# EAGLE design scheda_trasduttori_v2 (EAGLE 6.5.0)

## Sheet 1 of 4
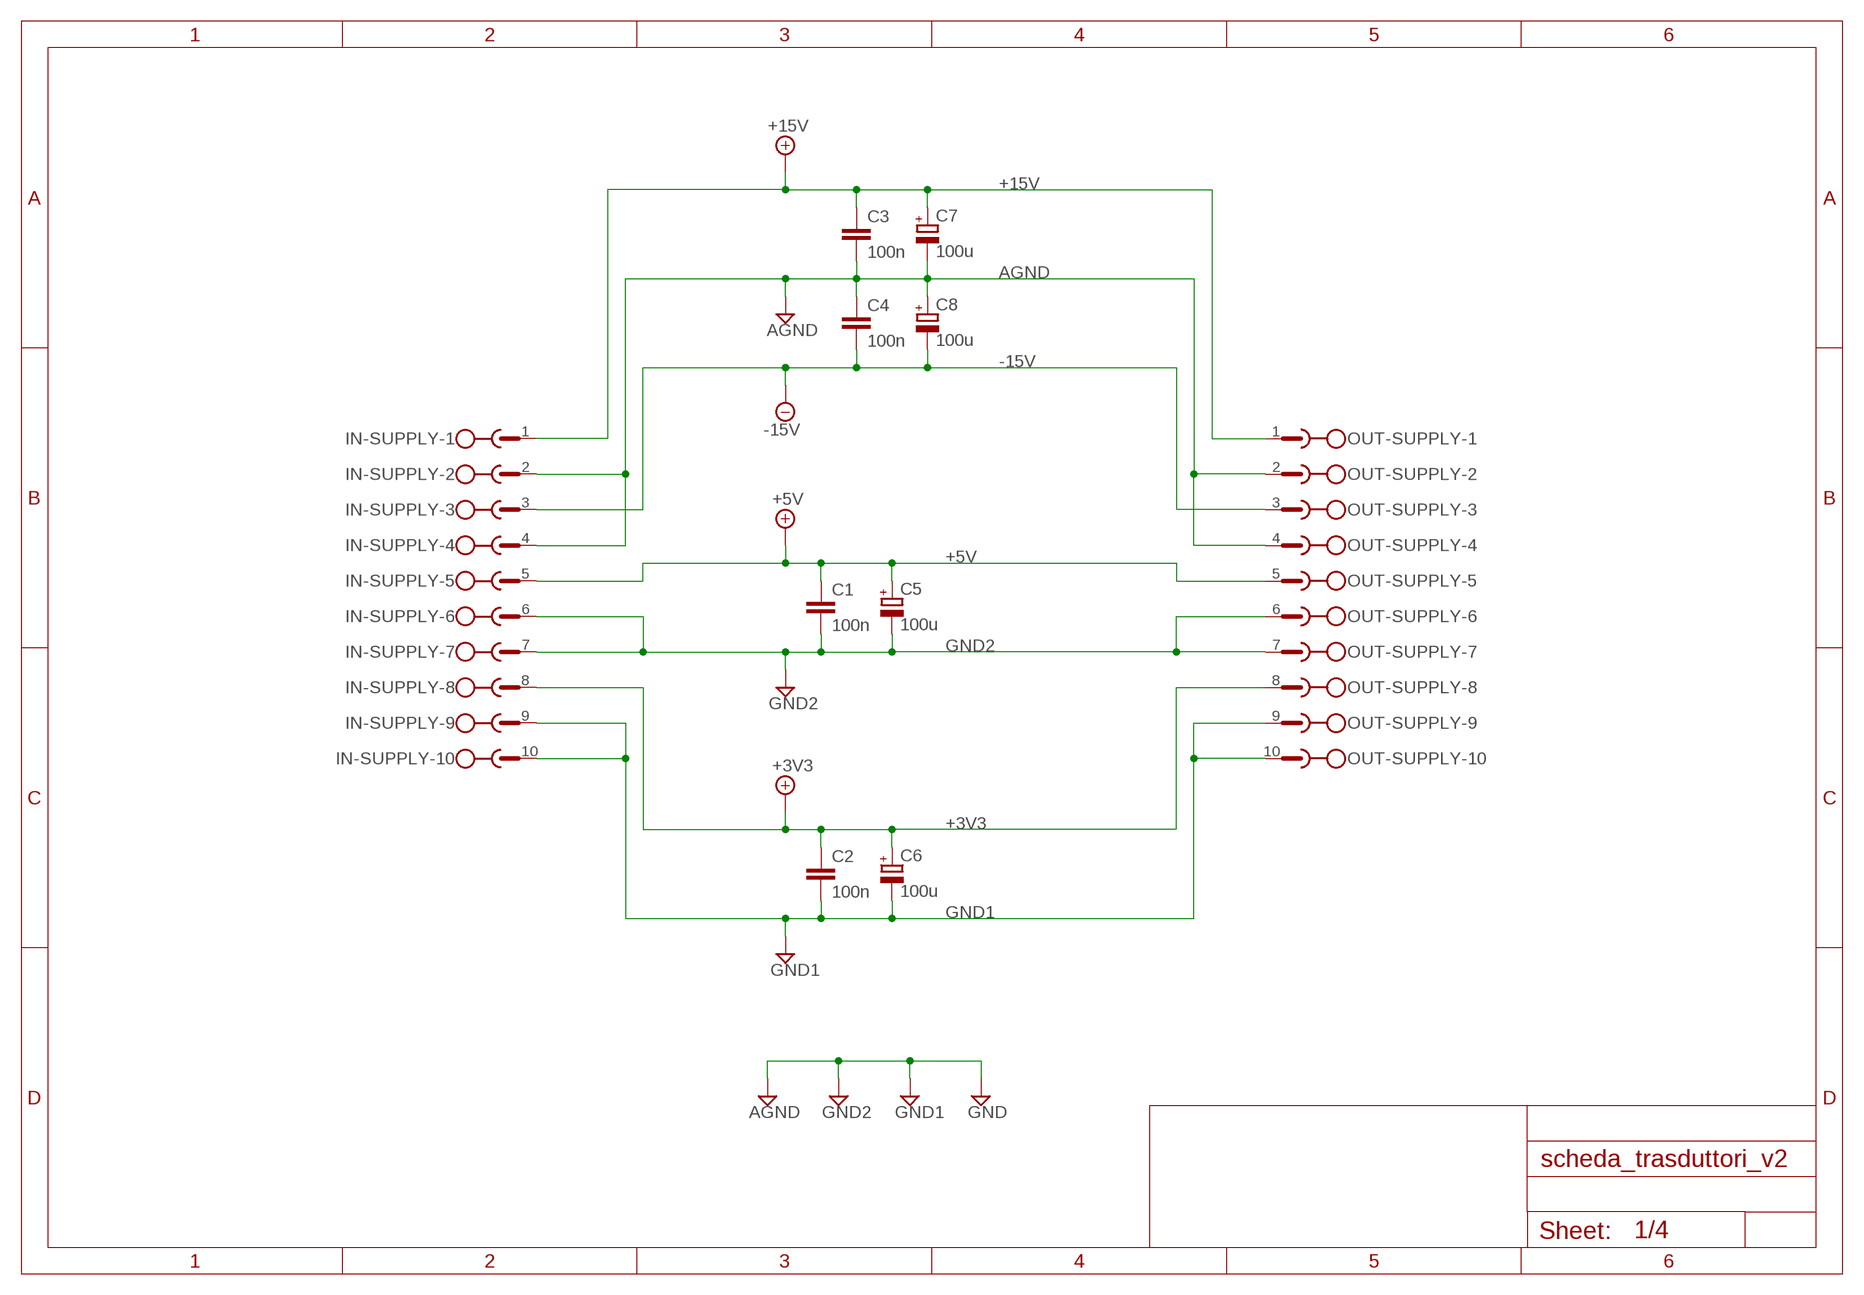
[diagram p0: schematic, sheet 1]

### Parts
C1  100n  C2,5-3  [C2.5-3]
C2  100n  C2,5-3  [C2.5-3]
C3  100n  C2,5-3  [C2.5-3]
C4  100n  C2,5-3  [C2.5-3]
C5  100u  CPOL-EUE2.5-7  [E2,5-7]
C6  100u  CPOL-EUE2.5-7  [E2,5-7]
C7  100u  CPOL-EUE2.5-7  [E2,5-7]
C8  100u  CPOL-EUE2.5-7  [E2,5-7]
IN-SUPPLY  MSTBA10  [MSTBA10]
OUT-SUPPLY  MSTBA10  [MSTBA10]

### Nets
+3V3: C2.1 C6.+ IN-SUPPLY.8 OUT-SUPPLY.8
+5V: C1.1 C5.+ IN-SUPPLY.5 OUT-SUPPLY.5 ; also sheet 2,4
+15V: C3.1 C7.+ IN-SUPPLY.1 OUT-SUPPLY.1 ; also sheet 2,3,4
-15V: C4.2 C8.- IN-SUPPLY.3 OUT-SUPPLY.3 ; also sheet 2,3,4
AGND: C3.2 C4.1 C7.- C8.+ IN-SUPPLY.2 IN-SUPPLY.4 OUT-SUPPLY.2 OUT-SUPPLY.4 ; also sheet 2,3,4
GND1: C2.2 C6.- IN-SUPPLY.9 IN-SUPPLY.10 OUT-SUPPLY.9 OUT-SUPPLY.10 ; also sheet 2,3
GND2: C1.2 C5.- IN-SUPPLY.6 IN-SUPPLY.7 OUT-SUPPLY.6 OUT-SUPPLY.7 ; also sheet 2,4

## Sheet 2 of 4
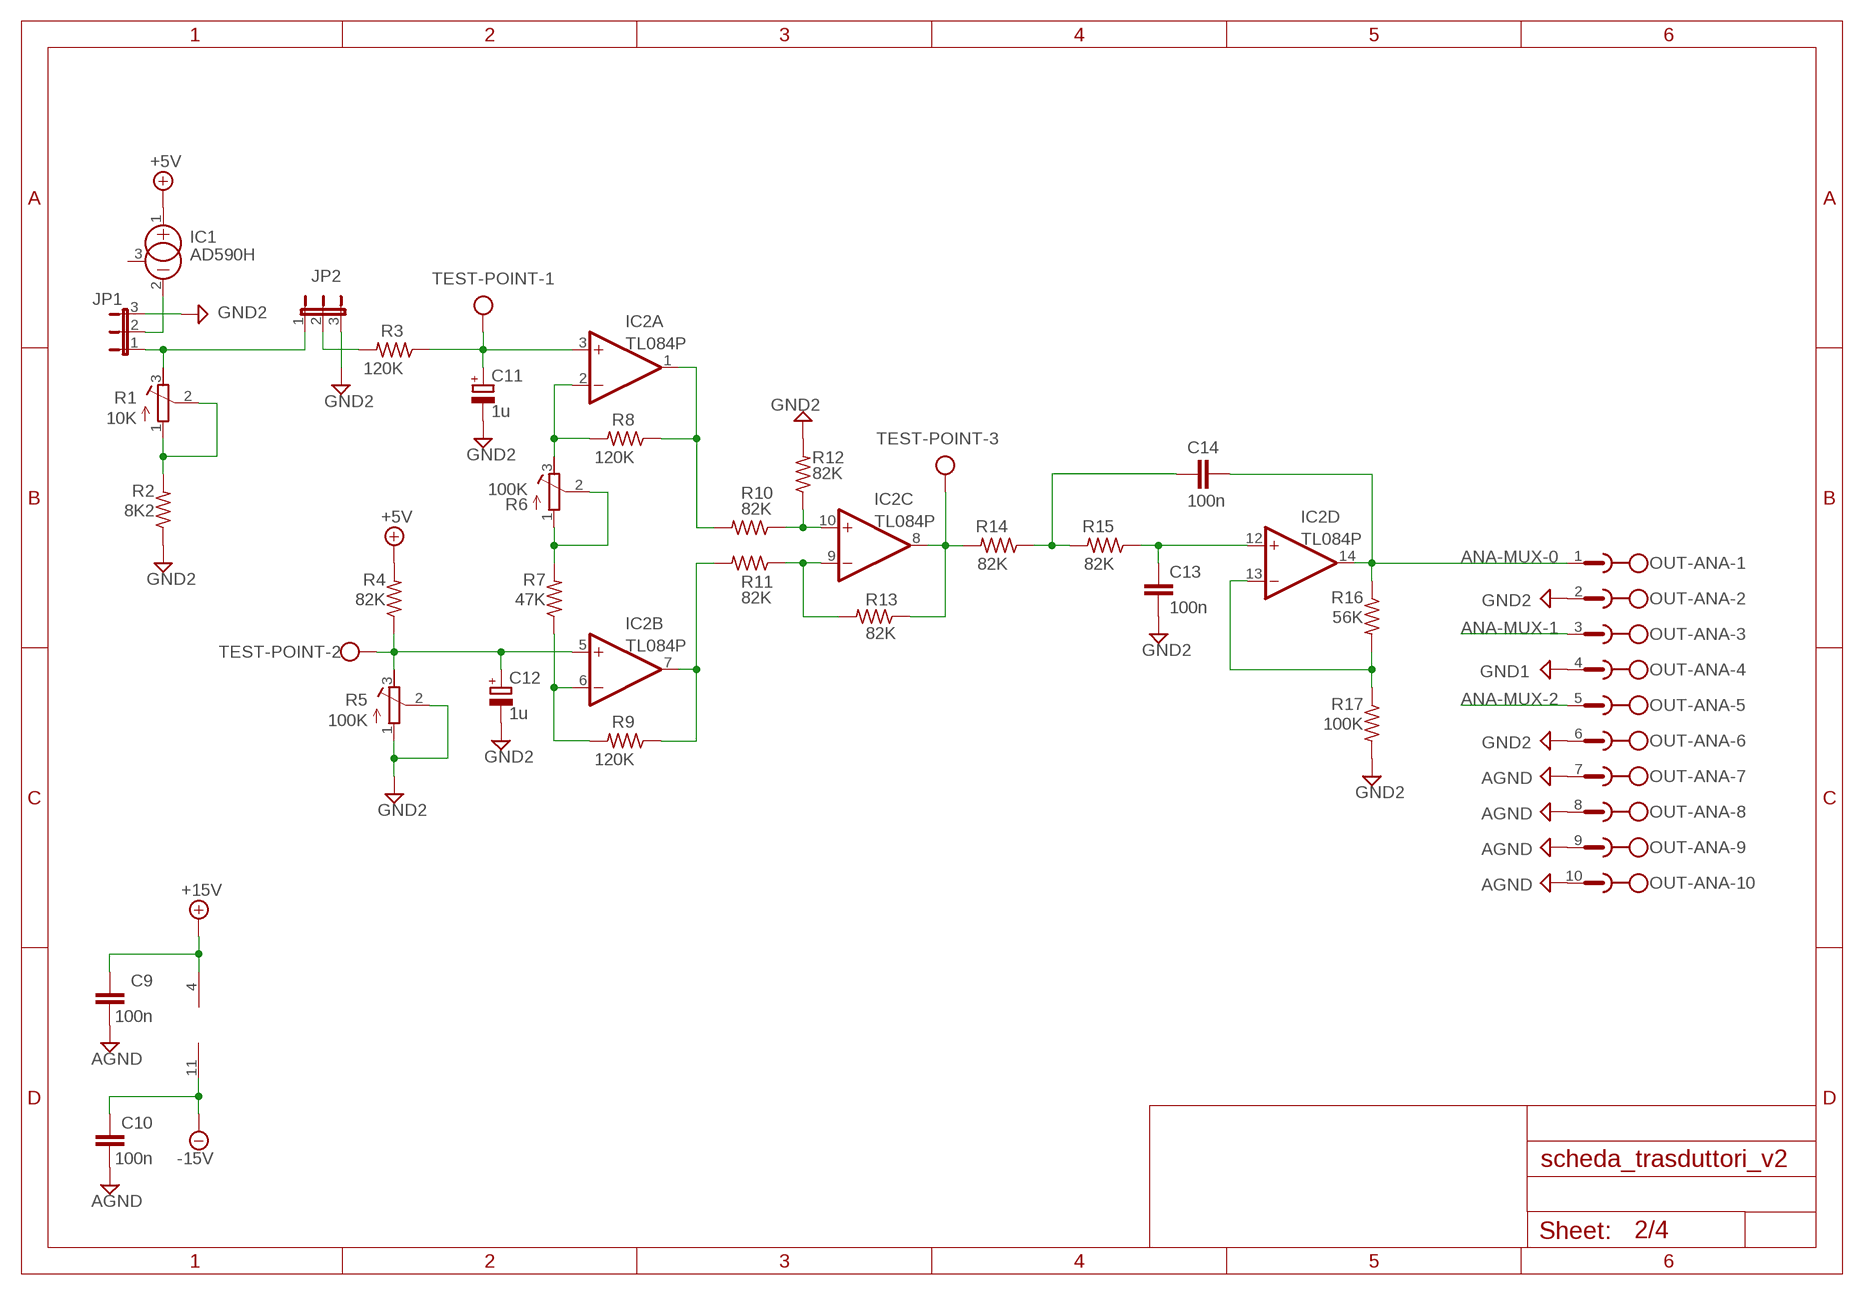
[diagram p1: schematic, sheet 2]

### Parts
C9  100n  C-EU025-024X044  [C025-024X044]
C10  100n  C-EU025-024X044  [C025-024X044]
C11  1u  CPOL-EUE5-8.5  [E5-8,5]
C12  1u  CPOL-EUE5-8.5  [E5-8,5]
C13  100n  C-EU025-024X044  [C025-024X044]
C14  100n  C-EU025-024X044  [C025-024X044]
IC1  AD590H  [TO18]
IC2  TL084P  [DIL14]
JP1  JP2E  [JP2]
JP2  JP2E  [JP2]
OUT-ANA  MSTBA10  [MSTBA10]
R1  10K  R-TRIMM64W  [RTRIM64W]
R2  8K2  R-US_0204/7  [0204/7]
R3  120K  R-US_0204/7  [0204/7]
R4  82K  R-US_0204/7  [0204/7]
R5  100K  R-TRIMM64W  [RTRIM64W]
R6  100K  R-TRIMM64W  [RTRIM64W]
R7  47K  R-US_0204/7  [0204/7]
R8  120K  R-US_0204/7  [0204/7]
R9  120K  R-US_0204/7  [0204/7]
R10  82K  R-US_0204/7  [0204/7]
R11  82K  R-US_0204/7  [0204/7]
R12  82K  R-US_0204/7  [0204/7]
R13  82K  R-US_0204/7  [0204/7]
R14  82K  R-US_0204/7  [0204/7]
R15  82K  R-US_0204/7  [0204/7]
R16  56K  R-US_0204/7  [0204/7]
R17  100K  R-US_0204/7  [0204/7]
TEST-POINT  W237-103  [W237-103]

### Nets
+5V: IC1.1(+) R4.2 ; also sheet 1,4
+15V: C9.2 IC2.4(P:V+) ; also sheet 1,3,4
-15V: C10.2 IC2.11(P:V-) ; also sheet 1,3,4
AGND: C9.1 C10.1 OUT-ANA.7 OUT-ANA.8 OUT-ANA.9 OUT-ANA.10 ; also sheet 1,3,4
ANA-MUX-0: C14.2 IC2.14(D:OUT) OUT-ANA.1 R16.1
ANA-MUX-1: OUT-ANA.3 ; also sheet 3
ANA-MUX-2: OUT-ANA.5 ; also sheet 4
GND1: OUT-ANA.4 ; also sheet 1,3
GND2: C11.- C12.- C13.1 JP1.3 JP2.3 OUT-ANA.2 OUT-ANA.6 R2.1 R5.1(E) R5.2(S) R12.2 R17.2 ; also sheet 1,4
N$1: R1.1(E) R1.2(S) R2.2
N$2: IC1.2(-) JP1.2
N$3: R6.1(E) R6.2(S) R7.2
N$4: C11.+ IC2.3(A:+IN) R3.1 TEST-POINT.1
N$5: IC2.2(A:-IN) R6.3(A) R8.2
N$6: IC2.1(A:OUT) R8.1 R10.2
N$7: JP2.2 R3.2
N$8: JP1.1 JP2.1 R1.3(A)
N$9: C12.+ IC2.5(B:+IN) R4.1 R5.3(A) TEST-POINT.2
N$10: IC2.6(B:-IN) R7.1 R9.2
N$11: IC2.7(B:OUT) R9.1 R11.2
N$12: IC2.10(C:+IN) R10.1 R12.1
N$13: IC2.9(C:-IN) R11.1 R13.2
N$14: IC2.8(C:OUT) R13.1 R14.2 TEST-POINT.3
N$16: C14.1 R14.1 R15.2
N$17: C13.2 IC2.12(D:+IN) R15.1
N$18: IC2.13(D:-IN) R16.2 R17.1
Unconnected: IC1.3(CAN)

## Sheet 3 of 4
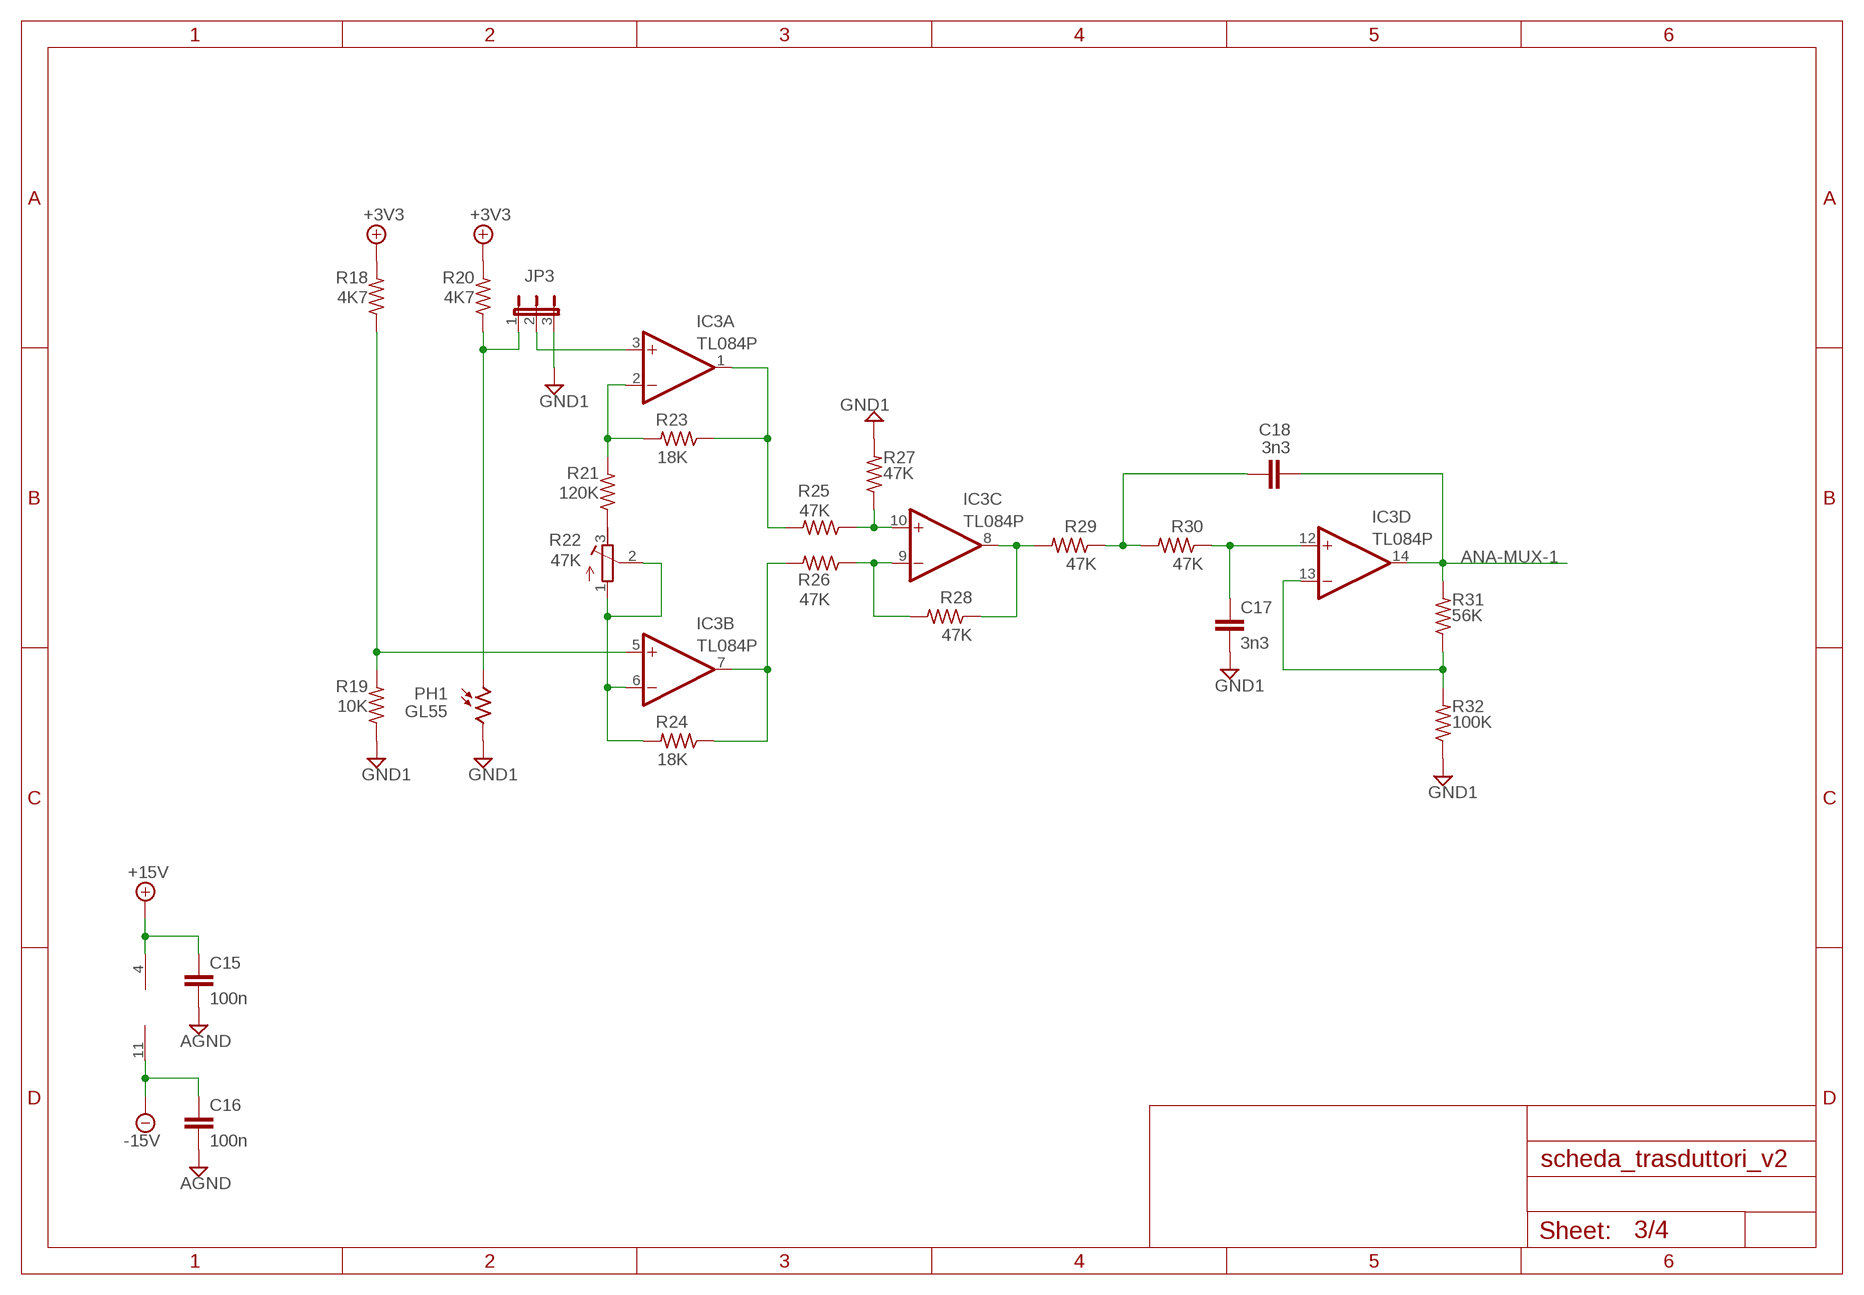
[diagram p2: schematic, sheet 3]

### Parts
C15  100n  C-EU025-025X050  [C025-025X050]
C16  100n  C-EU025-025X050  [C025-025X050]
C17  3n3  C-EU025-025X050  [C025-025X050]
C18  3n3  C-EU025-025X050  [C025-025X050]
IC3  TL084P  [DIL14]
JP3  JP2E  [JP2]
PH1  GL55  A1050_09  [T0-46-A10XX]
R18  4K7  R-US_0204/7  [0204/7]
R19  10K  R-US_0204/7  [0204/7]
R20  4K7  R-US_0204/7  [0204/7]
R21  120K  R-US_0204/7  [0204/7]
R22  47K  R-TRIMM64W  [RTRIM64W]
R23  18K  R-US_0204/7  [0204/7]
R24  18K  R-US_0204/7  [0204/7]
R25  47K  R-US_0204/7  [0204/7]
R26  47K  R-US_0204/7  [0204/7]
R27  47K  R-US_0204/7  [0204/7]
R28  47K  R-US_0204/7  [0204/7]
R29  47K  R-US_0204/7  [0204/7]
R30  47K  R-US_0204/7  [0204/7]
R31  56K  R-US_0204/7  [0204/7]
R32  100K  R-US_0204/7  [0204/7]

### Nets
+4.1V: R18.2 R20.2 ; supply symbol labelled +3V3
+15V: C15.1 IC3.4(P:V+) ; also sheet 1,2,4
-15V: C16.1 IC3.11(P:V-) ; also sheet 1,2,4
AGND: C15.2 C16.2 ; also sheet 1,2,4
ANA-MUX-1: C18.2 IC3.14(D:OUT) R31.2 ; also sheet 2
GND1: C17.2 JP3.3 PH1.2 R19.1 R27.2 R32.1 ; also sheet 1,2
N$15: IC3.5(B:+IN) R18.1 R19.2
N$19: JP3.1 PH1.1 R20.1
N$20: R21.1 R22.3(A)
N$21: IC3.6(B:-IN) R22.1(E) R22.2(S) R24.2
N$22: IC3.7(B:OUT) R24.1 R26.2
N$23: IC3.1(A:OUT) R23.1 R25.2
N$24: IC3.2(A:-IN) R21.2 R23.2
N$25: IC3.10(C:+IN) R25.1 R27.1
N$26: IC3.9(C:-IN) R26.1 R28.2
N$27: IC3.8(C:OUT) R28.1 R29.2
N$28: C17.1 IC3.12(D:+IN) R30.1
N$29: IC3.13(D:-IN) R31.1 R32.2
N$30: C18.1 R29.1 R30.2
N$31: IC3.3(A:+IN) JP3.2

## Sheet 4 of 4
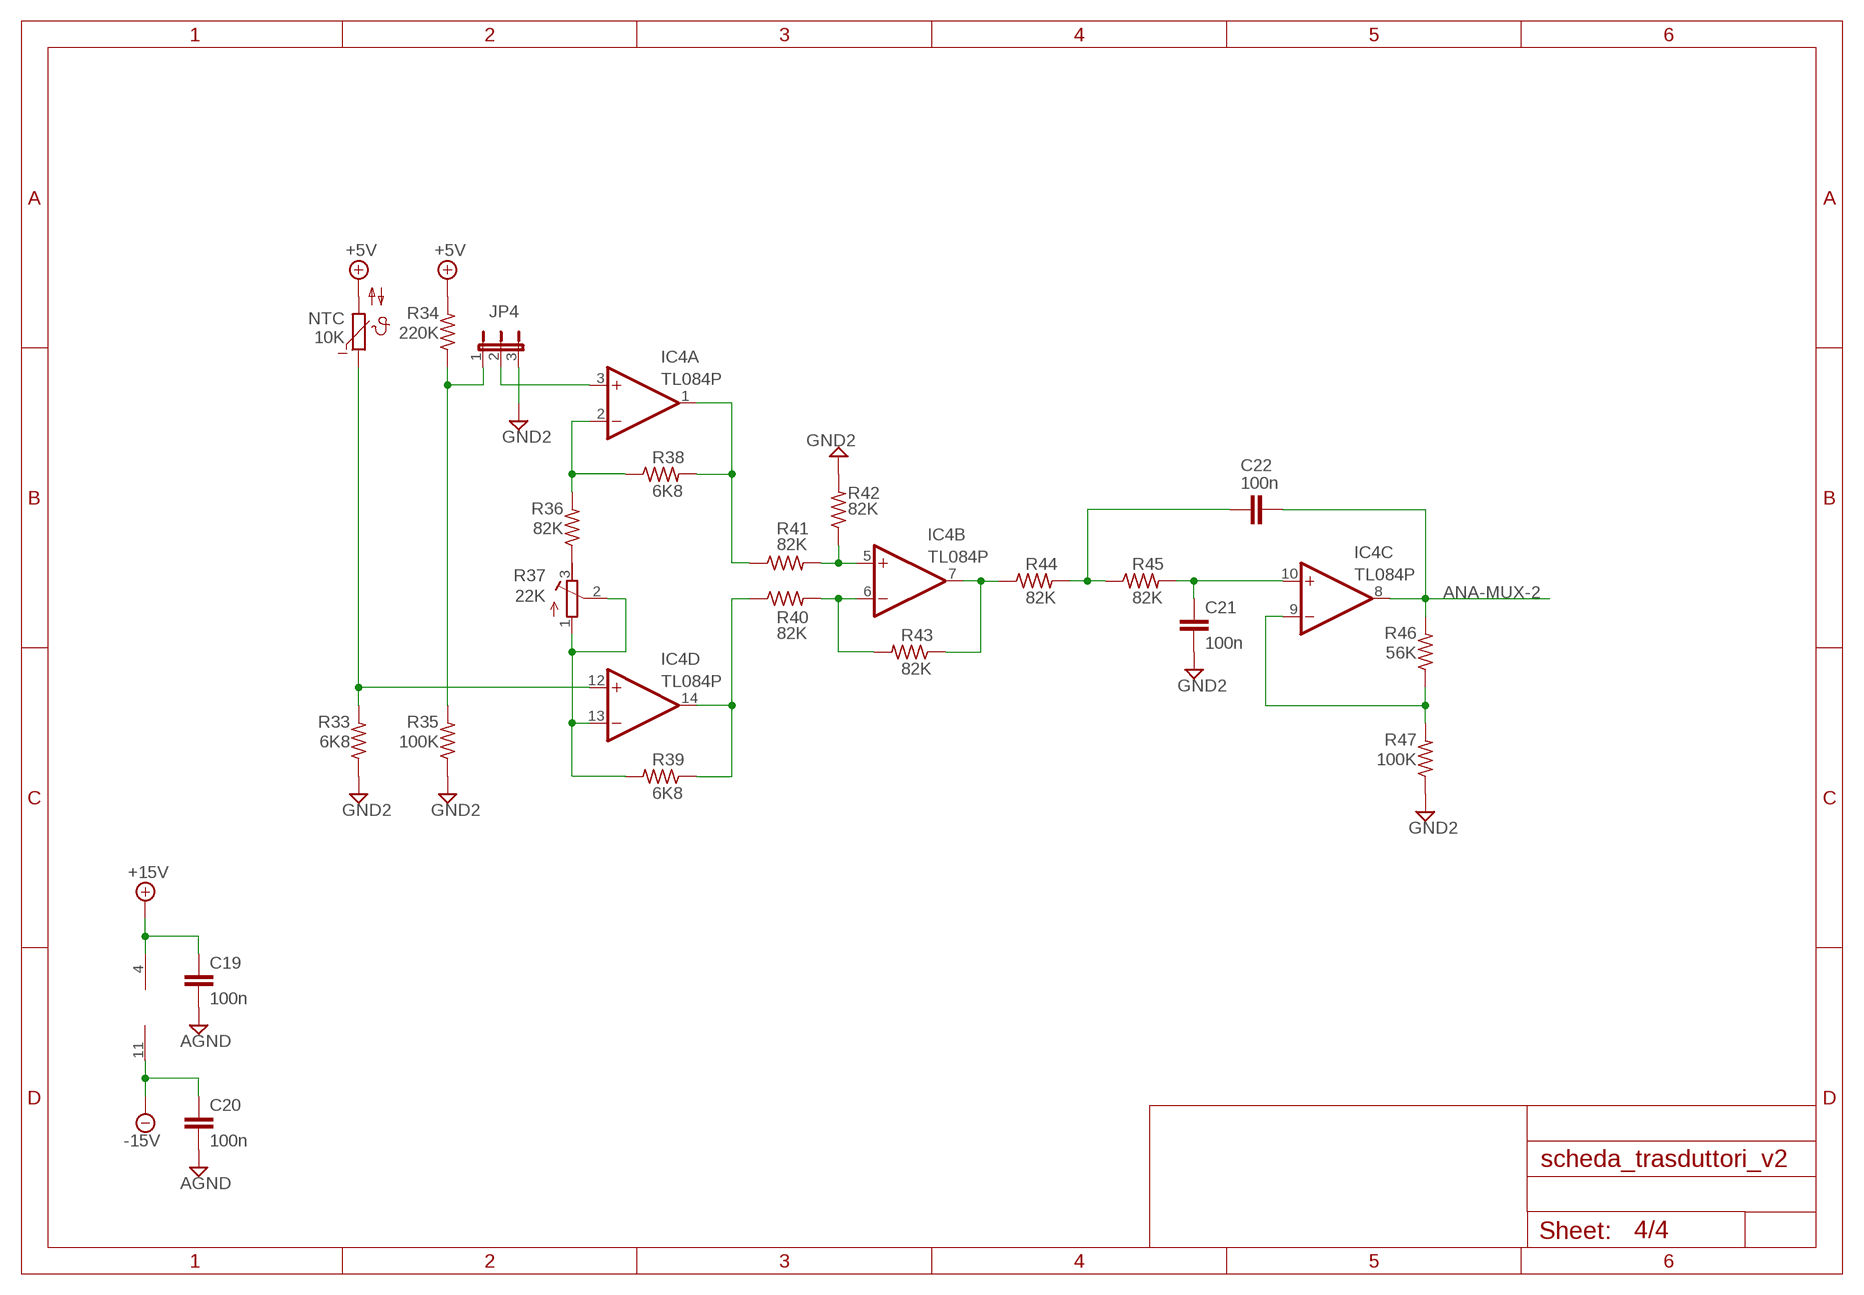
[diagram p3: schematic, sheet 4]

### Parts
C19  100n  C-EU025-025X050  [C025-025X050]
C20  100n  C-EU025-025X050  [C025-025X050]
C21  100n  C-EU025-025X050  [C025-025X050]
C22  100n  C-EU025-025X050  [C025-025X050]
IC4  TL084P  [DIL14]
JP4  JP2E  [JP2]
NTC  10K  NTC640  [P640]
R33  6K8  R-US_0204/7  [0204/7]
R34  220K  R-US_0204/7  [0204/7]
R35  100K  R-US_0204/7  [0204/7]
R36  82K  R-US_0204/7  [0204/7]
R37  22K  R-TRIMM64W  [RTRIM64W]
R38  6K8  R-US_0204/7  [0204/7]
R39  6K8  R-US_0204/7  [0204/7]
R40  82K  R-US_0204/7  [0204/7]
R41  82K  R-US_0204/7  [0204/7]
R42  82K  R-US_0204/7  [0204/7]
R43  82K  R-US_0204/7  [0204/7]
R44  82K  R-US_0204/7  [0204/7]
R45  82K  R-US_0204/7  [0204/7]
R46  56K  R-US_0204/7  [0204/7]
R47  100K  R-US_0204/7  [0204/7]

### Nets
+5V: NTC.2 R34.2 ; also sheet 1,2
+15V: C19.1 IC4.4(P:V+) ; also sheet 1,2,3
-15V: C20.1 IC4.11(P:V-) ; also sheet 1,2,3
AGND: C19.2 C20.2 ; also sheet 1,2,3
ANA-MUX-2: C22.2 IC4.8(C:OUT) R46.2 ; also sheet 2
GND2: C21.2 JP4.3 R33.1 R35.1 R42.2 R47.1 ; also sheet 1,2
N$32: C21.1 IC4.10(C:+IN) R45.2
N$33: IC4.9(C:-IN) R46.1 R47.2
N$34: C22.1 R44.2 R45.1
N$35: IC4.12(D:+IN) NTC.1 R33.2
N$36: R36.1 R37.3(A)
N$37: IC4.2(A:-IN) R36.2 R38.1
N$38: IC4.1(A:OUT) R38.2 R40.1
N$39: IC4.13(D:-IN) R37.1(E) R37.2(S) R39.2
N$40: IC4.14(D:OUT) R39.1 R41.1
N$41: IC4.6(B:-IN) R41.2 R43.2
N$42: IC4.5(B:+IN) R40.2 R42.1
N$43: IC4.7(B:OUT) R43.1 R44.1
N$44: JP4.1 R34.1 R35.2
N$45: IC4.3(A:+IN) JP4.2

## Library data of the parts
C1-C4 = capacitor-wima:C: CAPACITOR naming: grid - package width
C5-C8 C11 C12 = rcl:CPOL-EU: POLARIZED CAPACITOR, European symbol
C9 C10 C13-C22 = rcl:C-EU: CAPACITOR, European symbol
IC1 = linear:AD590H: TEMPERATURE SENSOR current output
IC2-IC4 = linear:TL084: OP AMP
IN-SUPPLY OUT-ANA OUT-SUPPLY = ITIS:MSTBA10
JP1-JP4 = jumper:JP2E: JUMPER
NTC = ptc-ntc:NTC640: PHILIPS NTC; OC_FARNELL: unknown; OC_NEWARK: unknown
PH1 = photo-elements:A10: Sensor Robust Light Sensing Applications Outdoor Light Sensing Application Source: http://optoelectronics.perkinelmer.com/content/Datasheets/DTS_PhotocellsA1050.pdf; TYPE: GL55
R1 R5 R6 R22 R37 = resistor:R-TRIMM: Trimm resistor
R2-R4 R7-R21 R23-R32 = rcl:R-US_: RESISTOR, American symbol
R33-R36 R38-R47 = resistor:R-US_: RESISTOR, American symbol
TEST-POINT = con-wago-500:W237-103: WAGO SCREW CLAMP; MPN: 237-103; OC_FARNELL: unknown; OC_NEWARK: 18M7116

## Board
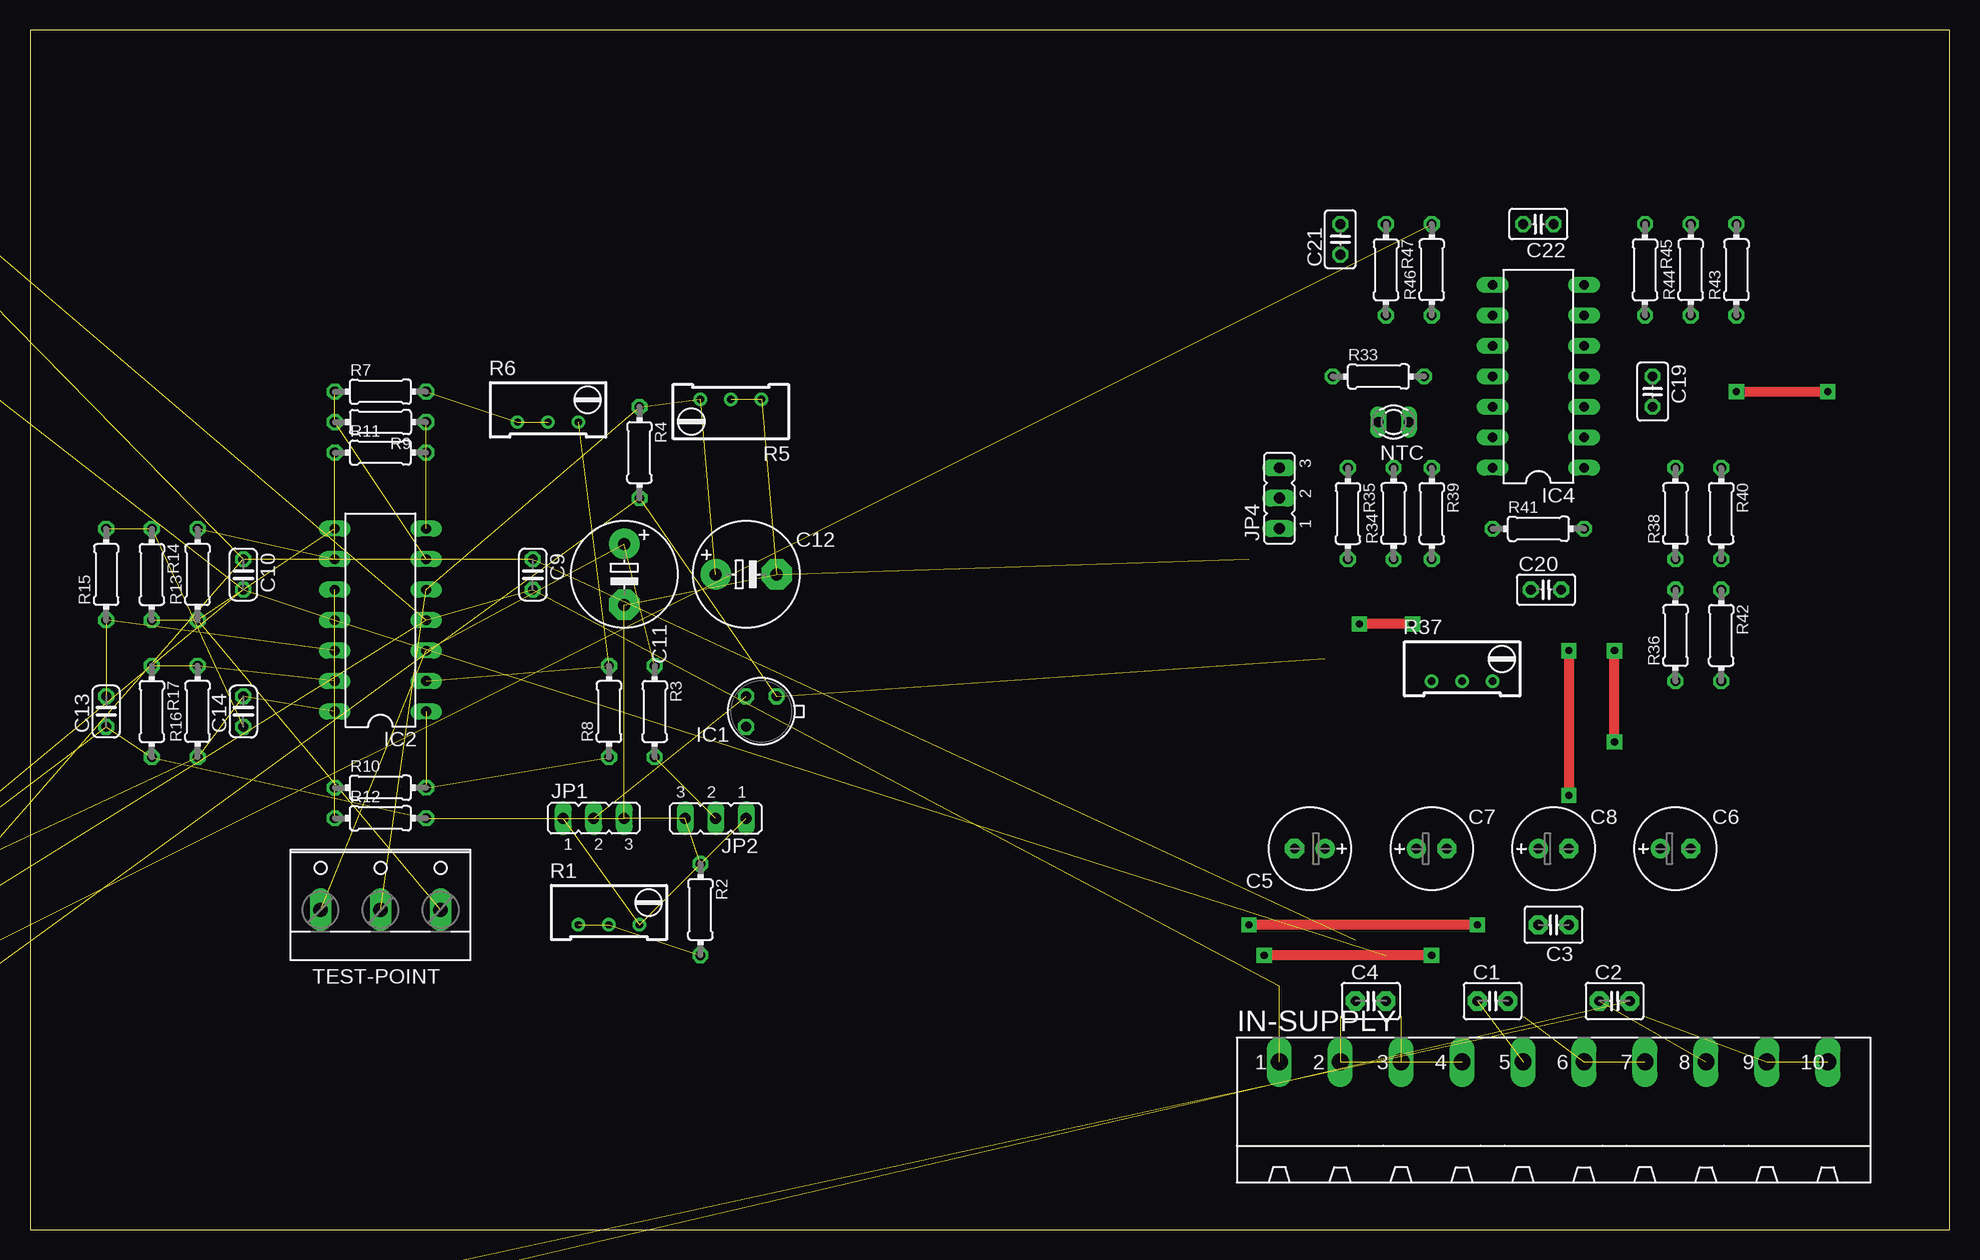
[diagram p4: board, top side]
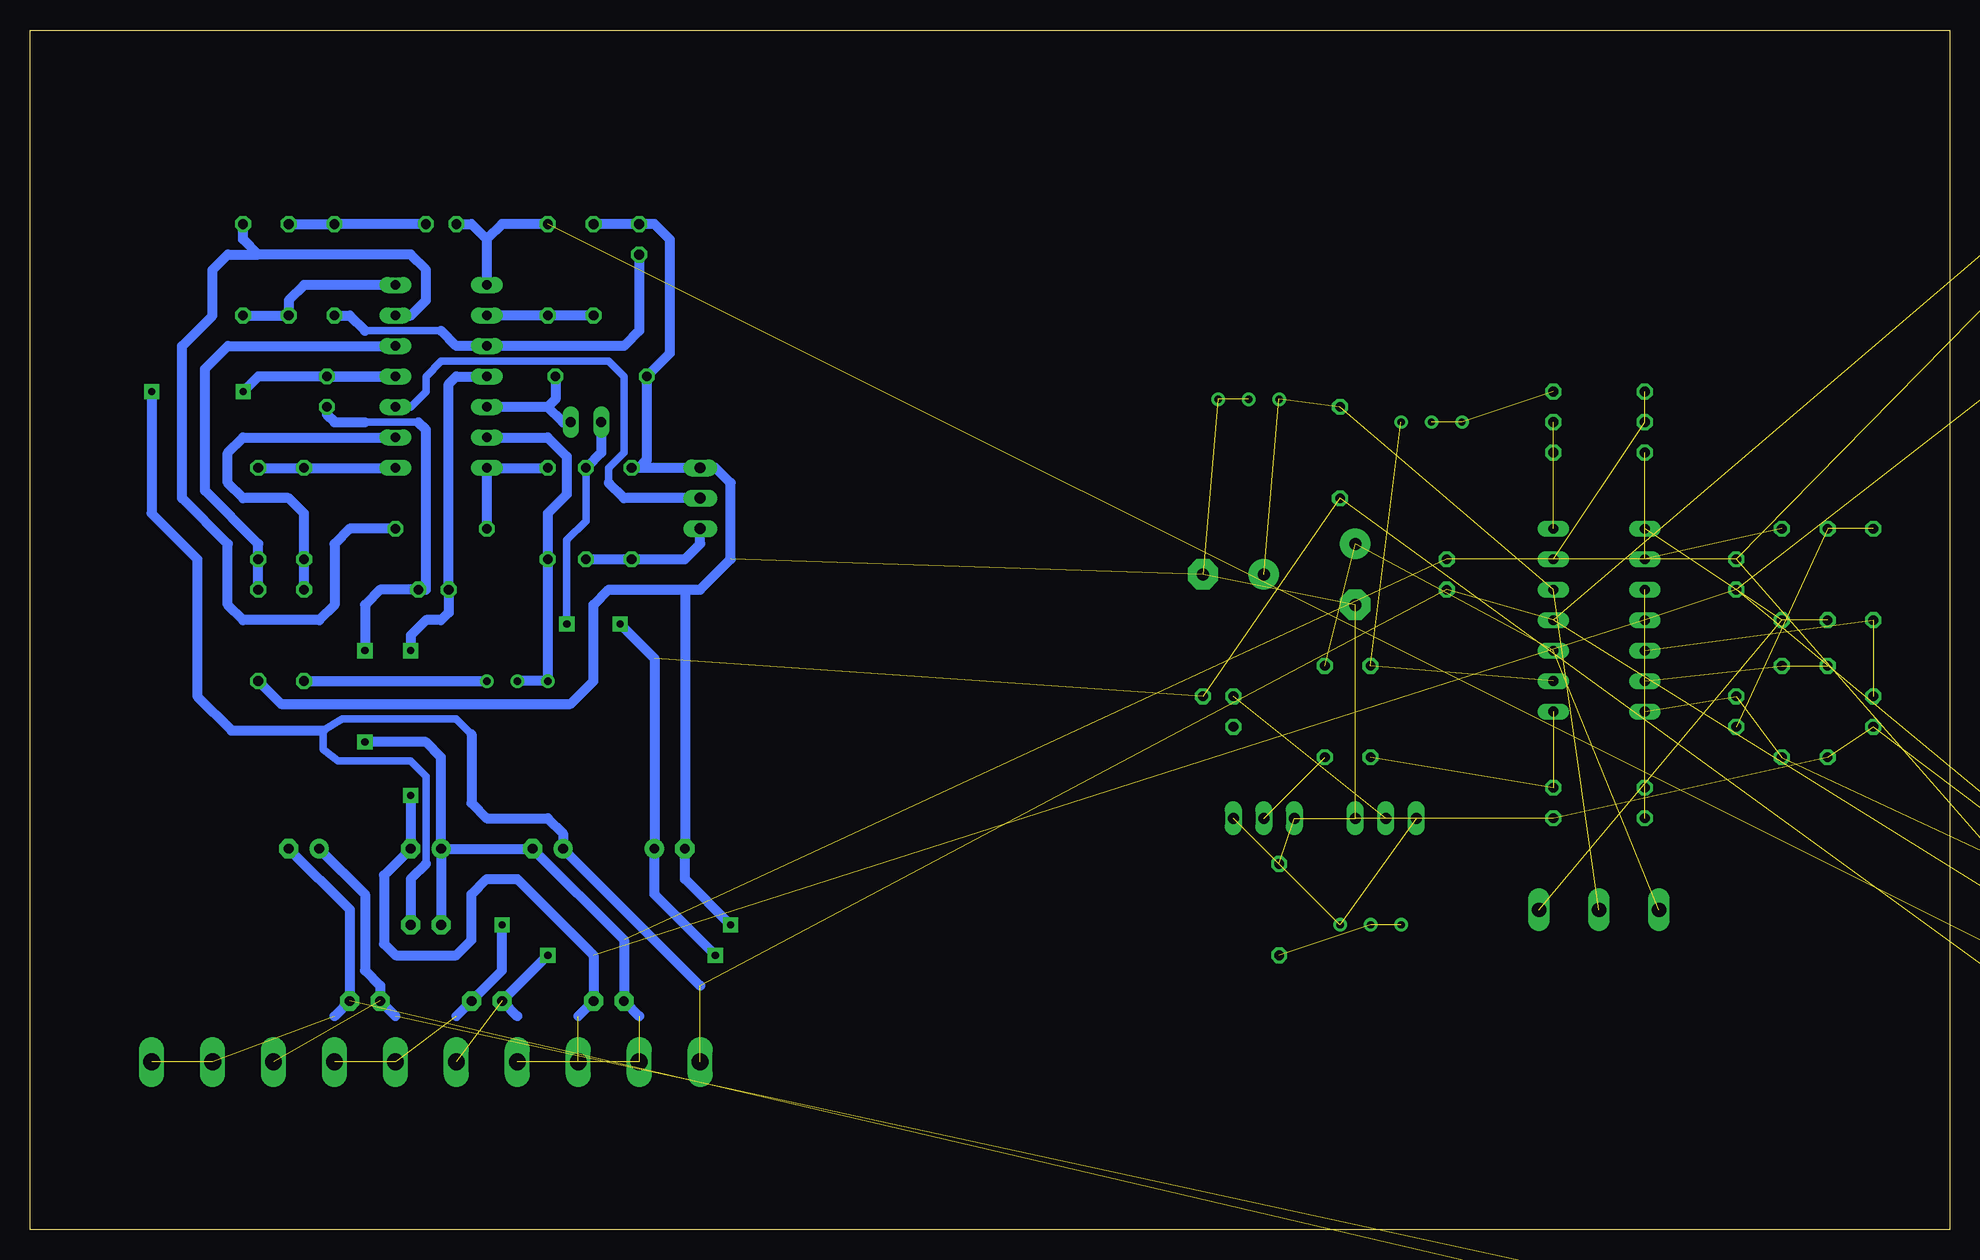
[diagram p5: board, bottom side, seen from below]

Size 160 x 100 mm. Coordinates in mm from the lower left corner, seen from the top.
Outline: 0,0 160,0 160,100 0,100 0,0
Copper layers (1*16): Top 0.035mm / dielectric 1.5mm / Bottom 0.035mm
Design rules "default": minimum track width 10mil, minimum drill 24mil, track to track 8mil, track to pad 8mil, pad to pad 8mil, via to via 8mil, smd to smd 8mil, copper to edge 40mil, drill to drill 8mil, minimum pad ring 10mil, minimum via ring 8mil, stop-mask expansion 4mil, vias tented up to drill 0mil, thermal gap 10mil

### Footprints (pad centres in the part's own frame; a part is rotated, then mirrored left to right if it is on the bottom)
C2.5-3 = drill 0.813 pad 1.6 octagon: 1 -1.27,0; 2 1.27,0
E2,5-7 = drill 0.813 pad 1.6: + -1.27,0 | drill 0.813 pad 1.6 octagon: - 1.27,0
C025-024X044 = drill 0.813 octagon: 1 -1.27,0; 2 1.27,0
E5-8,5 = drill 1.016 pad 2.54: + -2.54,0 | drill 1.016 pad 2.54 octagon: - 2.54,0
C025-025X050 = drill 0.813 octagon: 1 -1.27,0; 2 1.27,0
TO18 = drill 0.813 octagon: 1 -1.27,-1.27; 2 1.27,-1.27; 3 1.27,1.27
DIL14 = drill 0.813 long: 1 -7.62,-3.81; 2 -5.08,-3.81; 3 -2.54,-3.81; 4 0,-3.81; 5 2.54,-3.81; 6 5.08,-3.81; 7 7.62,-3.81; 8 7.62,3.81; 9 5.08,3.81; 10 2.54,3.81; 11 0,3.81; 12 -2.54,3.81; 13 -5.08,3.81; 14 -7.62,3.81
MSTBA10 = drill 1.397 long: 1 -22.86,5.08; 2 -17.78,5.08; 3 -12.7,5.08; 4 -7.62,5.08; 5 -2.54,5.08; 6 2.54,5.08; 7 7.62,5.08; 8 12.7,5.08; 9 17.78,5.08; 10 22.86,5.08
JP2 = drill 0.914 long: 1 -2.54,0; 2 0,0; 3 2.54,0
P640 = drill 0.813 long: 1 -1.27,0; 2 1.27,0
T0-46-A10XX = drill 0.7 pad 1.4: 1 -1.7,0; 2 1.7,0
RTRIM64W = drill 0.61: 1 1.27,-2.54; 2 1.27,0; 3 1.27,2.54
0204/7 = drill 0.813 octagon: 1 -3.81,0; 2 3.81,0
W237-103 = drill 1.194 long: 1 -5,-1.29; 2 0,-1.29; 3 5,-1.29

### Placement (x,y rotation side)
C1  121.92,19.05 0 top
C2  132.08,19.05 0 top
C3  127,25.4 180 top
C4  111.76,19.05 0 top
C5  106.68,31.75 180 top
C6  137.16,31.75 0 top
C7  116.84,31.75 0 top
C8  127,31.75 0 top
C9  41.91,54.61 270 top
C10  17.78,54.61 270 top
C11  49.53,54.61 270 top
C12  59.69,54.61 0 top
C13  6.35,43.18 90 top
C14  17.78,43.18 90 top
C15  -45.72,119.38 90 top  (outside the outline)
C16  -71.12,119.38 90 top  (outside the outline)
C17  -71.12,109.22 90 top  (outside the outline)
C18  -82.55,101.6 0 top  (outside the outline)
C19  135.25,69.85 270 top
C20  126.36,53.34 0 top
C21  109.22,82.55 90 top
C22  125.73,83.82 180 top
IC1  60.96,43.18 180 top
IC2  29.21,50.8 90 top
IC3  -58.42,115.57 90 top  (outside the outline)
IC4  125.73,71.12 90 top
IN-SUPPLY  127,8.89 0 top
JP1  46.99,34.29 0 top
JP2  57.15,34.29 180 top
JP3  -41.91,101.6 0 top  (outside the outline)
JP4  104.14,60.96 90 top
NTC  113.67,67.31 180 top
OUT-ANA  -58.42,-10.16 0 top  (outside the outline)
OUT-SUPPLY  -58.42,-25.4 0 top  (outside the outline)
PH1  -38.1,110.49 270 top  (outside the outline)
R1  48.26,26.67 270 top
R2  55.88,26.67 270 top
R3  52.07,43.18 270 top
R4  50.8,64.77 270 top
R5  58.42,67.94 90 top
R6  43.18,68.58 270 top
R7  29.21,69.85 0 top
R8  48.26,43.18 90 top
R9  29.21,67.31 180 top
R10  29.21,36.83 0 top
R11  29.21,64.77 0 top
R12  29.21,34.29 0 top
R13  13.97,54.61 90 top
R14  10.16,54.61 270 top
R15  6.35,54.61 90 top
R16  13.97,43.18 90 top
R17  10.16,43.18 270 top
R18  -40.64,119.38 270 top  (outside the outline)
R19  -36.83,119.38 90 top  (outside the outline)
R20  -43.18,110.49 90 top  (outside the outline)
R21  -58.42,102.23 0 top  (outside the outline)
R22  -58.42,97.79 270 top  (outside the outline)
R23  -46.99,110.49 90 top  (outside the outline)
R24  -58.42,132.08 0 top  (outside the outline)
R25  -76.2,109.22 270 top  (outside the outline)
R26  -58.42,129.54 0 top  (outside the outline)
R27  -76.2,119.38 90 top  (outside the outline)
R28  -58.42,127 180 top  (outside the outline)
R29  -80.01,119.38 90 top  (outside the outline)
R30  -83.82,109.22 90 top  (outside the outline)
R31  -80.01,109.22 270 top  (outside the outline)
R32  -83.82,119.38 270 top  (outside the outline)
R33  112.39,71.12 0 top
R34  113.67,59.69 90 top
R35  109.86,59.69 270 top
R36  137.16,49.53 90 top
R37  119.38,46.99 270 top
R38  137.16,59.69 90 top
R39  116.84,59.69 270 top
R40  140.97,59.69 270 top
R41  125.73,58.42 0 top
R42  140.97,49.53 270 top
R43  142.24,80.01 90 top
R44  138.43,80.01 90 top
R45  134.62,80.01 270 top
R46  116.84,80.01 90 top
R47  113.03,80.01 270 top
TEST-POINT  29.21,27.94 0 top

### Tracks (layer width: path | path; a pad name or v marks a point on that pad's centre or on a via)
+3V3  (2 unrouted)
  Bottom 0.813: 129.54,17.78 C2.1 130.81,20.32 132.08,21.59 132.08,27.94 C6.+
+4.1V  (1 unrouted)
+5V  (via drill 0.6 pad 1.27)  (4 unrouted)
  Top 0.813: v115.25,50.48 v110.81,50.48 | v116.84,22.86 v102.87,22.86
  Bottom 0.61: R34.2 113.67,59.05 115.25,57.47 v115.25,50.48
  Bottom 0.813: NTC.2 112.39,64.77 R34.2 | v110.81,50.48 107.95,47.62 C5.+ 107.95,27.94 v102.87,22.86 | 119.38,17.78 C1.1 v116.84,22.86
+15V  (via drill 0.6 pad 1.27)  (6 unrouted)
  Top 0.813: v142.24,69.85 v149.86,69.85
  Bottom 0.61: 127,30.48 127,37.78 128.27,39.05 134.3,39.05 135.57,40.01 135.57,41.59 133.99,42.55 124.46,42.55 123.19,41.27
  Bottom 0.813: C19.1 IC4.4 140.97,71.12 v142.24,69.85 | 123.19,41.27 123.19,35.56 121.92,34.29 116.84,34.29 115.57,33.02 C7.+ 104.14,20.32 | v149.86,69.85 149.86,59.69 146.05,55.88 146.05,44.45 143.19,41.59 135.57,41.59 | 127,30.48 128.27,29.21 C3.1
-15V  (via drill 0.6 pad 1.27)  (6 unrouted)
  Top 0.813: v128.27,48.26 v128.27,36.2
  Bottom 0.813: IC4.11 124.46,71.12 125.09,70.48 C20.1 125.09,51.44 125.73,50.8 127,50.8 128.27,49.53 v128.27,48.26 | v128.27,36.2 C8.- 130.49,29.53 130.49,23.81 129.54,22.86 124.46,22.86 123.19,24.13 123.19,27.94 121.92,29.21 119.38,29.21 113.03,22.86 C4.2 114.3,17.78
AGND  (via drill 0.6 pad 1.27)  (12 unrouted)
  Top 0.813: v132.08,40.64 v132.08,48.26
  Bottom 0.61: 132.08,67.31 127.64,67.31
  Bottom 0.813: 127.64,67.31 127,66.67 127,53.34 C20.2 130.81,53.34 132.08,52.07 v132.08,48.26 | C19.2 135.25,67.94 134.62,67.31 132.08,67.31 | C8.+ 125.73,39.37 127,40.64 v132.08,40.64 | C8.+ C7.- 110.49,24.13 C4.1 109.22,17.78 | C8.+ C3.2
ANA-MUX-0  (3 unrouted)
ANA-MUX-1  (3 unrouted)
ANA-MUX-2  (1 unrouted)
  Bottom 0.813: R46.2 120.65,83.82 121.92,82.55 | 121.92,82.55 IC4.8 | C22.2 123.19,83.82 121.92,82.55
GND1  (11 unrouted)
  Bottom 0.813: 134.62,17.78 C2.2 133.35,26.67 C6.-
GND2  (via drill 0.6 pad 1.27)  (16 unrouted)
  Top 0.813: v120.65,25.4 v101.6,25.4
  Bottom 0.813: 109.22,63.5 JP4.3 102.87,63.5 101.6,62.23 101.6,55.88 104.14,53.34 105.41,53.34 | 109.22,63.5 R35.1 | R47.1 C21.2 107.95,83.82 106.68,82.55 106.68,73.03 R33.1 108.58,64.14 109.22,63.5 | R42.2 139.06,43.81 114.94,43.81 113.03,45.72 113.03,52.07 111.76,53.34 105.41,53.34 | 105.41,53.34 C5.- 105.41,29.21 v101.6,25.4 | 124.46,17.78 C1.2 120.65,21.59 v120.65,25.4
N$1  (2 unrouted)
N$2  (1 unrouted)
N$3  (2 unrouted)
N$4  (3 unrouted)
N$5  (2 unrouted)
N$6  (2 unrouted)
N$7  (1 unrouted)
N$8  (2 unrouted)
N$9  (4 unrouted)
N$10  (2 unrouted)
N$11  (2 unrouted)
N$12  (2 unrouted)
N$13  (2 unrouted)
N$14  (3 unrouted)
N$15  (2 unrouted)
N$16  (2 unrouted)
N$17  (2 unrouted)
N$18  (2 unrouted)
N$19  (2 unrouted)
N$20  (1 unrouted)
N$21  (3 unrouted)
N$22  (2 unrouted)
N$23  (2 unrouted)
N$24  (2 unrouted)
N$25  (2 unrouted)
N$26  (2 unrouted)
N$27  (2 unrouted)
N$28  (2 unrouted)
N$29  (2 unrouted)
N$30  (2 unrouted)
N$31  (1 unrouted)
N$32
  Bottom 0.61: 125.73,74.93 132.08,74.93
  Bottom 0.813: R45.2 133.35,76.2 132.08,74.93 | 125.73,74.93 124.46,73.66 IC4.10 110.49,73.66 109.22,74.93 C21.1
N$33
  Bottom 0.813: R47.2 R46.1 IC4.9
N$34
  Bottom 0.813: C22.1 R45.1 R44.2
N$35
  Bottom 0.813: NTC.1 115.57,67.31 116.84,68.58 | 116.84,68.58 IC4.12 | R33.2 116.2,69.22 116.84,68.58
N$36
  Bottom 0.813: R36.1 R37.3
N$37
  Bottom 0.813: R36.2 R38.1 137.16,59.69 138.43,60.96 142.24,60.96 143.51,62.23 143.51,64.77 142.24,66.04 IC4.2
N$38
  Bottom 0.813: R40.1 R38.2 IC4.1
N$39
  Bottom 0.813: R37.2 R37.1 R39.2 116.84,59.69 115.25,61.28 115.25,64.45 116.84,66.04 IC4.13
N$40
  Bottom 0.813: R39.1 IC4.14 R41.1
N$41
  Bottom 0.813: IC4.6 128.27,76.2 127,77.47 127,80.01 128.27,81.28 140.97,81.28 | 140.97,81.28 142.24,82.55 R43.2 | R41.2 133.35,58.42 134.62,57.15 134.62,52.07 135.89,50.8 142.24,50.8 143.51,52.07 143.51,57.15 147.32,60.96 147.32,73.66 144.78,76.2 144.78,80.01 143.51,81.28 140.97,81.28
N$42
  Bottom 0.813: R42.1 R40.2 140.97,57.15 145.41,61.59 145.41,71.75 143.51,73.66 IC4.5
N$43
  Bottom 0.813: R43.1 R44.1 138.43,77.47 137.16,78.74 IC4.7
N$44
  Bottom 0.813: R34.1 R35.2 105.41,55.88 104.14,57.15 JP4.1
N$45
  Bottom 0.61: 111.76,62.23 111.76,63.5 110.49,64.77 110.49,71.12 111.76,72.39 125.73,72.39 127,71.12 127,69.85 128.27,68.58 IC4.3
  Bottom 0.813: JP4.2 110.49,60.96 111.76,62.23